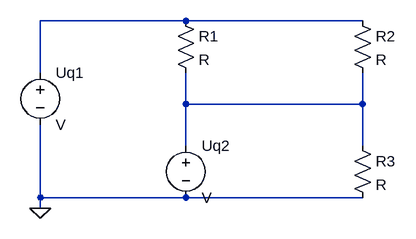
[diagram p0: schematic KSA_4.asc]
KSA_4.asc, the LTspice schematic file:
Version 4
SHEET 1 880 680
WIRE 176 48 -48 48
WIRE 448 48 176 48
WIRE -48 128 -48 48
WIRE 176 176 176 128
WIRE 448 176 448 128
WIRE 448 176 176 176
WIRE 176 240 176 176
WIRE 448 240 448 176
WIRE -48 320 -48 208
WIRE 176 320 -48 320
WIRE 448 320 176 320
WIRE -48 336 -48 320
FLAG -48 336 0
SYMBOL res 160 32 R0
SYMATTR InstName R1
SYMBOL res 432 32 R0
SYMATTR InstName R2
SYMBOL res 432 224 R0
SYMATTR InstName R3
SYMBOL voltage -48 112 R0
SYMATTR InstName Uq1
SYMBOL voltage 176 224 R0
SYMATTR InstName Uq2

The netlist it stands for:
* KSA_4.asc
R1 N001 N002 R
R2 N001 N002 R
R3 N002 0 R
V§Uq1 N001 0 V
V§Uq2 N002 0 V
.backanno
.end